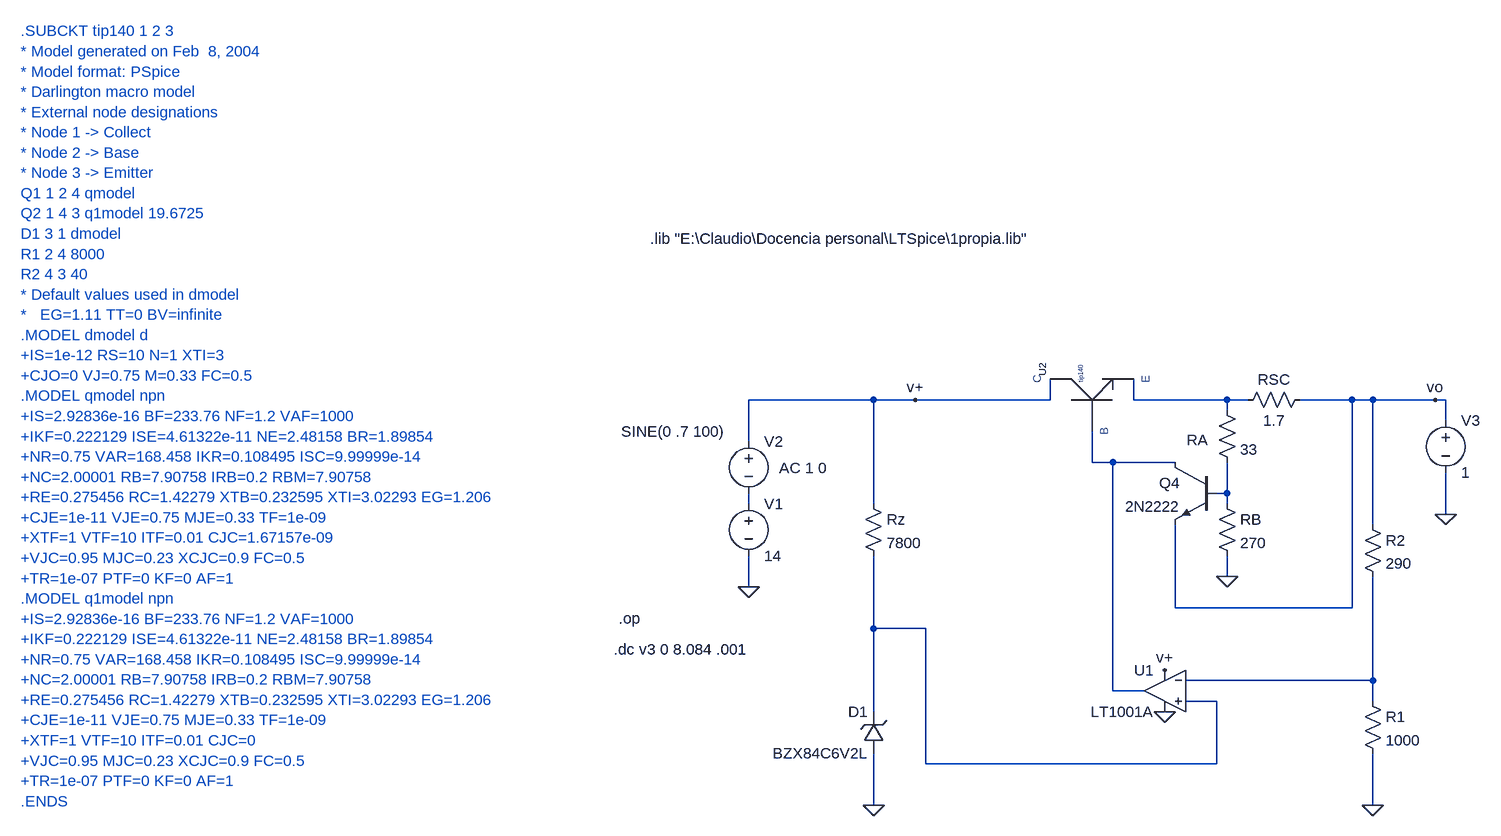
[diagram p0: schematic regulador3.asc]
regulador3.asc, the LTspice schematic file:
Version 4
SHEET 1 1316 680
WIRE 224 -48 32 -48
WIRE 288 -48 224 -48
WIRE 496 -48 496 -80
WIRE 496 -48 288 -48
WIRE 624 -48 624 -80
WIRE 768 -48 624 -48
WIRE 800 -48 768 -48
WIRE 960 -48 880 -48
WIRE 992 -48 960 -48
WIRE 1088 -48 992 -48
WIRE 1104 -48 1088 -48
WIRE 768 -32 768 -48
WIRE 1104 -16 1104 -48
WIRE 32 16 32 -48
WIRE 560 48 560 0
WIRE 592 48 560 48
WIRE 688 48 592 48
WIRE 768 96 768 48
WIRE 768 96 752 96
WIRE 32 112 32 96
WIRE 224 112 224 -48
WIRE 768 112 768 96
WIRE 1104 128 1104 64
WIRE 992 144 992 -48
WIRE 768 224 768 192
WIRE 32 240 32 192
WIRE 688 272 688 144
WIRE 960 272 960 -48
WIRE 960 272 688 272
WIRE 224 304 224 192
WIRE 304 304 224 304
WIRE 992 384 992 224
WIRE 992 384 704 384
WIRE 592 400 592 48
WIRE 640 400 592 400
WIRE 752 416 704 416
WIRE 992 416 992 384
WIRE 224 432 224 304
WIRE 304 512 304 304
WIRE 752 512 752 416
WIRE 752 512 304 512
WIRE 224 576 224 496
WIRE 992 576 992 496
FLAG 32 240 0
FLAG 224 576 0
FLAG 992 576 0
FLAG 1104 128 0
FLAG 1088 -48 vo
FLAG 768 224 0
FLAG 288 -48 v+
FLAG 672 368 v+
FLAG 672 432 0
DATAFLAG 992 -48 ""
DATAFLAG 448 -48 ""
DATAFLAG 992 304 ""
DATAFLAG 224 304 ""
DATAFLAG 592 240 ""
SYMBOL voltage 32 96 R0
WINDOW 123 0 0 Left 2
WINDOW 39 0 0 Left 2
SYMATTR InstName V1
SYMATTR Value 14
SYMBOL voltage 32 0 R0
WINDOW 123 47 57 Left 2
WINDOW 39 0 0 Left 2
WINDOW 3 -196 1 Left 2
SYMATTR Value2 AC 1 0
SYMATTR Value SINE(0 .7 100)
SYMATTR InstName V2
SYMBOL res 208 96 R0
SYMATTR InstName Rz
SYMATTR Value 7800
SYMBOL zener 240 496 R180
WINDOW 0 24 64 Left 2
WINDOW 3 24 0 Left 2
SYMATTR InstName D1
SYMATTR Value BZX84C6V2L
SYMATTR Description Diode
SYMATTR Type diode
SYMBOL res 976 128 R0
SYMATTR InstName R2
SYMATTR Value 290
SYMBOL res 976 400 R0
SYMATTR InstName R1
SYMATTR Value 1000
SYMBOL npn 752 48 M0
SYMATTR InstName Q4
SYMATTR Value 2N2222
SYMBOL res 896 -64 R90
WINDOW 0 0 56 VBottom 2
WINDOW 3 32 56 VTop 2
SYMATTR InstName RSC
SYMATTR Value 1.7
SYMBOL res 752 -48 R0
WINDOW 0 -46 62 Left 2
SYMATTR InstName RA
SYMATTR Value 33
SYMBOL res 752 96 R0
SYMATTR InstName RB
SYMATTR Value 270
SYMBOL OpAmps\\LT1001A 672 336 M0
SYMATTR InstName U1
SYMBOL voltage 1104 -32 R0
WINDOW 123 0 0 Left 0
WINDOW 39 0 0 Left 0
SYMATTR InstName V3
SYMATTR Value 1
SYMBOL Propia\\Darlington\ npn 560 -48 R270
SYMATTR Value tip140
SYMATTR InstName U2
TEXT -168 288 Left 2 !.op
TEXT -176 336 Left 2 !.dc v3 0 8.084 .001
TEXT -1088 -616 Left 2 ;.SUBCKT tip140 1 2 3\n* Model generated on Feb  8, 2004\n* Model format: PSpice\n* Darlington macro model\n* External node designations\n* Node 1 -> Collect\n* Node 2 -> Base\n* Node 3 -> Emitter\nQ1 1 2 4 qmodel\nQ2 1 4 3 q1model 19.6725\nD1 3 1 dmodel\nR1 2 4 8000\nR2 4 3 40\n* Default values used in dmodel\n*   EG=1.11 TT=0 BV=infinite\n.MODEL dmodel d\n+IS=1e-12 RS=10 N=1 XTI=3\n+CJO=0 VJ=0.75 M=0.33 FC=0.5\n.MODEL qmodel npn\n+IS=2.92836e-16 BF=233.76 NF=1.2 VAF=1000\n+IKF=0.222129 ISE=4.61322e-11 NE=2.48158 BR=1.89854\n+NR=0.75 VAR=168.458 IKR=0.108495 ISC=9.99999e-14\n+NC=2.00001 RB=7.90758 IRB=0.2 RBM=7.90758\n+RE=0.275456 RC=1.42279 XTB=0.232595 XTI=3.02293 EG=1.206\n+CJE=1e-11 VJE=0.75 MJE=0.33 TF=1e-09\n+XTF=1 VTF=10 ITF=0.01 CJC=1.67157e-09\n+VJC=0.95 MJC=0.23 XCJC=0.9 FC=0.5\n+TR=1e-07 PTF=0 KF=0 AF=1\n.MODEL q1model npn\n+IS=2.92836e-16 BF=233.76 NF=1.2 VAF=1000\n+IKF=0.222129 ISE=4.61322e-11 NE=2.48158 BR=1.89854\n+NR=0.75 VAR=168.458 IKR=0.108495 ISC=9.99999e-14\n+NC=2.00001 RB=7.90758 IRB=0.2 RBM=7.90758\n+RE=0.275456 RC=1.42279 XTB=0.232595 XTI=3.02293 EG=1.206\n+CJE=1e-11 VJE=0.75 MJE=0.33 TF=1e-09\n+XTF=1 VTF=10 ITF=0.01 CJC=0\n+VJC=0.95 MJC=0.23 XCJC=0.9 FC=0.5\n+TR=1e-07 PTF=0 KF=0 AF=1\n.ENDS
TEXT -120 -296 Left 2 !.lib "E:\\Claudio\\Docencia personal\\LTSpice\\1propia.lib"

The netlist it stands for:
* regulador3.asc
V1 N004 0 14
V2 v+ N004 SINE(0 .7 100) AC 1 0
Rz v+ N005 7800
D1 0 N005 BZX84C6V2L
R2 vo N006 290
R1 N006 0 1000
Q4 N002 N003 vo 0 2N2222
RSC vo N001 1.7
RA N001 N003 33
RB N003 0 270
XU1 N005 N006 v+ 0 N002 LT1001  ; LT1001A, pins In+ In- V+ V- OUT
V3 vo 0 1
XU2 v+ N002 N001 tip140  ; pins C B E
.model D D
.lib standard.dio
.model NPN NPN
.model PNP PNP
.lib standard.bjt
.op
.dc v3 0 8.084 .001
* .SUBCKT tip140 1 2 3
* * Model generated on Feb  8, 2004
* * Model format: PSpice
* * Darlington macro model
* * External node designations
* * Node 1 -> Collect
* * Node 2 -> Base
* * Node 3 -> Emitter
* Q1 1 2 4 qmodel
* Q2 1 4 3 q1model 19.6725
* D1 3 1 dmodel
* R1 2 4 8000
* R2 4 3 40
* * Default values used in dmodel
* *   EG=1.11 TT=0 BV=infinite
* .MODEL dmodel d
* +IS=1e-12 RS=10 N=1 XTI=3
* +CJO=0 VJ=0.75 M=0.33 FC=0.5
* .MODEL qmodel npn
* +IS=2.92836e-16 BF=233.76 NF=1.2 VAF=1000
* +IKF=0.222129 ISE=4.61322e-11 NE=2.48158 BR=1.89854
* +NR=0.75 VAR=168.458 IKR=0.108495 ISC=9.99999e-14
* +NC=2.00001 RB=7.90758 IRB=0.2 RBM=7.90758
* +RE=0.275456 RC=1.42279 XTB=0.232595 XTI=3.02293 EG=1.206
* +CJE=1e-11 VJE=0.75 MJE=0.33 TF=1e-09
* +XTF=1 VTF=10 ITF=0.01 CJC=1.67157e-09
* +VJC=0.95 MJC=0.23 XCJC=0.9 FC=0.5
* +TR=1e-07 PTF=0 KF=0 AF=1
* .MODEL q1model npn
* +IS=2.92836e-16 BF=233.76 NF=1.2 VAF=1000
* +IKF=0.222129 ISE=4.61322e-11 NE=2.48158 BR=1.89854
* +NR=0.75 VAR=168.458 IKR=0.108495 ISC=9.99999e-14
* +NC=2.00001 RB=7.90758 IRB=0.2 RBM=7.90758
* +RE=0.275456 RC=1.42279 XTB=0.232595 XTI=3.02293 EG=1.206
* +CJE=1e-11 VJE=0.75 MJE=0.33 TF=1e-09
* +XTF=1 VTF=10 ITF=0.01 CJC=0
* +VJC=0.95 MJC=0.23 XCJC=0.9 FC=0.5
* +TR=1e-07 PTF=0 KF=0 AF=1
* .ENDS
.lib "E:\Claudio\Docencia personal\LTSpice\1propia.lib"
.lib LTC.lib
.backanno
.end